# Altium schematic sheet discharge.SchDoc
size A
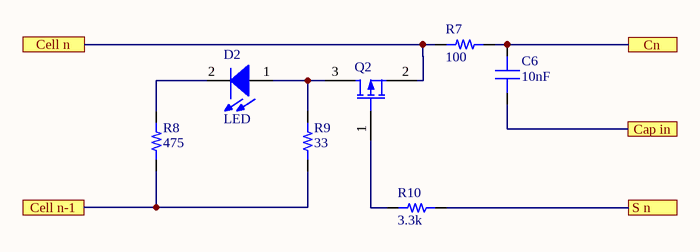
[diagram p0: discharge.SchDoc]

## Parts
C6  capacitance: 10nF  [0603]  (hidden comment: capacitor)
D2  LED  [0805_LED]
Q2  CMUDM8005 TR PFET  [CMUDM8005 TR SOT523]  (value not drawn)
R7  100  [RES 0603/1608]
R8  475  [RES 0603/1608]
R9  33  [RES 2512/6332]
R10  3.3k  [RES 0603/1608]

## Ports
Cap in, Cell n, Cell n-1, Cn, S n

## Nets
Cap in: C6.1 ; port Cap in
Cell n: Q2.2(S) R7.1 ; port Cell n
Cell n-1: R8.1 R9.1 ; port Cell n-1
Cn: C6.2 R7.2 ; port Cn
S n: R10.2 ; port S n
NetD2_1: D2.1(A) Q2.3(D) R9.2
NetD2_2: D2.2(K) R8.2
NetQ2_1: Q2.1(G) R10.1

## Library data of the parts
C6 = 1: Generic 0603 capacitor; id: 1; voltage: 50; dielectric: Ceramic; percent tolerance: 10; name: 0603 Capacitor; ESR: 1; package: 0603; quantity: 0
D2 = 19: Generic 0805 LED; id: 19; vr: 1; name: 0805 LED; numcircuits: 1; package: 0805; quantity: 0
Q2 = 13: MOSFET P-CH 20V 650MA SOT523; id: 13; type: P_Channel; vdsmax: 0; numcircuits: 1; rdson: 360m; vgsmax: 8; name: CMUDM8005 TR PFET; current: 650mA; package: SOT-523; quantity: 0; link: https://www.digikey.com/product-detail/en/central-semiconductor-corp/CMUDM8005-TR/CMUDM8005CT-ND/5324590
R7 R8 R10 = 1: id: 1; name: 0603 Resistor; percent tolerance: 5; package: 0603; quantity: 0
  R7: resistance: 100
  R8: resistance: 475
  R10: resistance: 3.3k
R9 = 4: id: 4; name: 2512 Resistor; percent tolerance: 5; resistance: 33; package: 2512; quantity: 0; createdby: Kevin